# EAGLE design SubBoard_V1 (EAGLE 9.6.2)
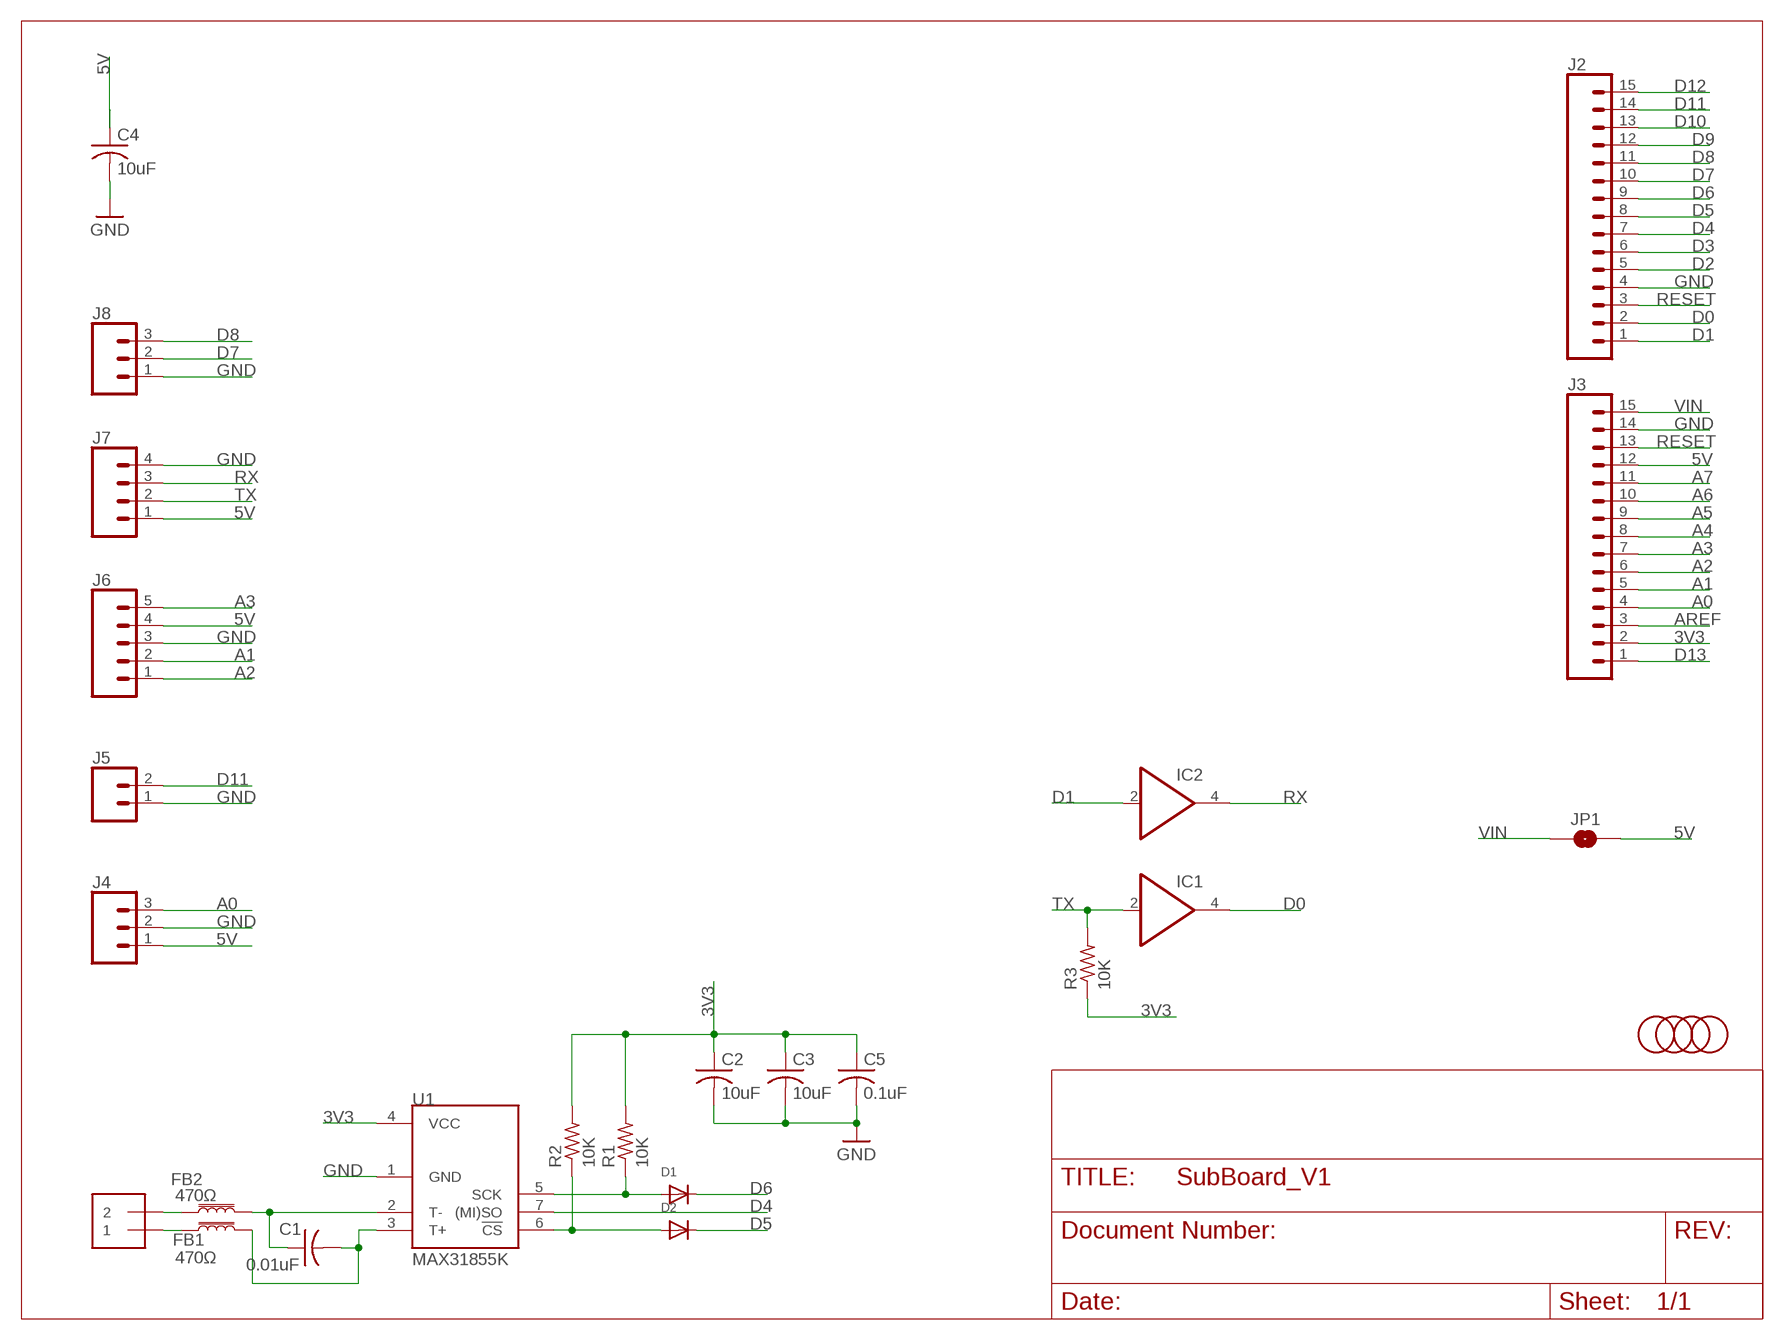
[diagram p0: schematic, sheet 1]

## Parts
C1  0.01uF  C-USC0603  [C0603]
C2  10uF  C-USC0603  [C0603]
C3  10uF  C-USC0603  [C0603]
C4  10uF  C-USC0603  [C0603]
C5  0.1uF  C-USC0603  [C0603]
D1  DIODESOD-523  [SOD-523]
D2  DIODESOD-523  [SOD-523]
FB1  470Ω  FERRITE_BEAD-0603-470Ω-100MHZ-1A-200MILIΩ  [0603]
FB2  470Ω  FERRITE_BEAD-0603-470Ω-100MHZ-1A-200MILIΩ  [0603]
IC1  74LVC1G07DBV  [SOT23-5]
IC2  74LVC1G07DBV  [SOT23-5]
J1  1X2-3.5MM  [1X2-3.5MM]
J2  CONN_15  [1X15]
J3  CONN_15  [1X15]
J4  CONN_03JST-PTH  [JST-3-PTH]
J5  CONN_02JST-PTH-2  [JST-2-PTH]
J6  CONN_05JST  [JST-5-PTH]
J7  CONN_04POLAR  [MOLEX-1X4]
J8  CONN_03JST-PTH  [JST-3-PTH]
JP1  JUMPER-SMT_2_NO_SILK  [SMT-JUMPER_2_NO_SILK]
R1  10K  R-US_R0402  [R0402]
R2  10K  R-US_R0402  [R0402]
R3  10K  R-US_R0402  [R0402]
U1  MAX31855K  [SO08]
U$1  FIDUCIAL  [FIDUCIAL_1MM]
U$2  FIDUCIAL  [FIDUCIAL_1MM]
U$3  FIDUCIAL  [FIDUCIAL_1MM]
U$4  FIDUCIAL  [FIDUCIAL_1MM]

## Nets
3V3: C2.1 C3.1 C5.1 J3.2 R1.2 R2.2 R3.1 U1.4(VCC)
5V: C4.1 J3.12 J4.1 J6.4 J7.1 JP1.2
A0: J3.4 J4.3
A1: J3.5 J6.2
A2: J3.6 J6.1
A3: J3.7 J6.5
A4: J3.8
A5: J3.9
A6: J3.10
A7: J3.11
AREF: J3.3
D0: IC1.4(O) J2.2
D1: IC2.2(I) J2.1
D2: J2.5
D3: J2.6
D4: J2.7 U1.7((MI)SO)
D5: D2.K(C) J2.8
D6: D1.K(C) J2.9
D7: J2.10 J8.2
D8: J2.11 J8.3
D9: J2.12
D10: J2.13
D11: J2.14 J5.2
D12: J2.15
D13: J3.1
GND: C2.2 C3.2 C4.2 C5.2 J2.4 J3.14 J4.2 J5.1 J6.3 J7.4 J8.1 U1.1(GND)
N$1: FB2.1 J1.2
N$2: FB1.1 J1.1
N$3: C1.1 FB2.2 U1.2(T-)
N$4: D1.A R1.1 U1.5(SCK)
N$5: C1.2 FB1.2 U1.3(T+)
N$6: D2.A R2.1 U1.6(!CS)
RESET: J2.3 J3.13
RX: IC2.4(O) J7.3
TX: IC1.2(I) J7.2 R3.2
VIN: J3.15 JP1.1

## Power pins joined to a net without a drawn wire
3V3: IC1.5(VCC) IC2.5(VCC)
GND: IC1.3(GND) IC2.3(GND)

## Library data of the parts
C1 = rcl:C-US: CAPACITOR, American symbol; LCSC: C1589; SPICEPREFIX: C
C2-C4 = rcl:C-US: CAPACITOR, American symbol; LCSC: C19702; SPICEPREFIX: C
C5 = rcl:C-US: CAPACITOR, American symbol; LCSC: C1591; SPICEPREFIX: C
D1 D2 = adafruit:DIODE: Diode SMADIODE - SMA Surface Mount Package 20V 1A Schottky Diode Digikey: 641-1014-6-ND DO-1N4148 - Through Hole Small Current Diode SOD-123 20V 1 A (.5mV Vf) Schottky Diode - Digikey: MBRX120TPMSCT-ND SOD-323 10V 570mA (.38mV Vf, 3ns) Schottky Diode - Digikey: ZLLS410CT-ND SOD-523 30V 30mA Schottky Diode (RB751S-40TE61) - Digikey: RB751S-40TE61CT-ND SOT23-R/W - SOT23 Package (R = Solder Paste/Reflow Ovens, W = Hand-Soldering) BAT54Film 40V 300mA - Digikey: 497-7162-1-ND; LCSC: C232841
FB1 FB2 = SparkFun-Coils:FERRITE_BEAD: Ferrite Bead (blocks, cores, rings, chokes, etc.) Inductor with layers of ferrite used to suppress high frequencies. Often used to isolate high frequency noise. SparkFun Products: IOIO-OTG - V2.2 <https://www.sparkfun.com/products/13613> SparkFun SAMD21 Mini Breakout <https://www.sparkfun.com/products/13664> SparkFun 6 Degrees of Freedom Breakout - LSM6DS3 <https://www.sparkfun.com/products/13339> SparkFun SAMD21 Dev Breakout <https://www.sparkfun.com/products/13672>; LCSC: C883591; PROD_ID: NDUC-12579
IC1 IC2 = 74xx-little-de:74*1G07: Single Buffer/Driver With Open-Drain Output; LCSC: C7829
J1 = adafruit:1X2: 3.5mm Terminal block http://www.ladyada.net/library/pcb/eaglelibrary.html; LCSC: C474892
J2 J3 = SparkFun-Connectors:CONN_15: Multi connection point. Often used as Generic Header-pin footprint for 0.1 inch spaced/style header connections On any of the 0.1 inch spaced packages, you can populate with these: Break Away Headers - Straight <https://www.sparkfun.com/products/116> (PRT-00116) Break Away Male Headers - Right Angle <https://www.sparkfun.com/products/553> (PRT-00553) Female Headers <https://www.sparkfun.com/products/115> (PRT-00115) Break Away Headers - Machine Pin <https://www.sparkfun.com/products/117> (PRT-00117) Break Away Female Headers - Swiss Machine Pin <https://www.sparkfun.com/products/743> (PRT-00743) For SCREWTERMINALS and SPRING TERMINALS visit here: Screw Terimnals on SparkFun.com <https://www.sparkfun.com/search/results?term=Screw+Terminals> (5mm/3.5mm/2.54mm spacing) This device is also useful as a general connection point to wire up your design to another part of your project. Our various solder wires solder well into these plated through hole pads. Hook-Up Wire - Assortment (Stranded, 22 AWG) <https://www.sparkfun.com/products/11375> (PRT-11375) Hook-Up Wire - Assortment (Solid Core, 22 AWG) <https://www.sparkfun.com/products/11367> (PRT-11367) View the entire wire category on our website here <https://www.sparkfun.com/categories/141> Special notes: Molex polarized connector foot print use with SKU : PRT-08231 with associated crimp pins and housings. 1MM SMD Version SKU: PRT-10208 NOTES ON THE VARIANTS LOCK and LOCK_LONGPADS... This footprint was designed to help hold the alignment of a through-hole component (i.e. 6-pin header) while soldering it into place. You may notice that each hole has been shifted either up or down by 0.005 of an inch from it's more standard position (which is a perfectly straight line). This slight alteration caused the pins (the squares in the middle) to touch the edges of the holes. Because they are alternating, it causes a "brace" to hold the component in place. 0.005 has proven to be the perfect amount of "off-center" position when using our standard breakaway headers. Although looks a little odd when you look at the bare footprint, once you have a header in there, the alteration is very hard to notice. Also,if you push a header all the way into place, it is covered up entirely on the bottom side.; LCSC: C2897378
J4 J8 = SparkFun-Connectors:CONN_03: Multi connection point. Often used as Generic Header-pin footprint for 0.1 inch spaced/style header connections On any of the 0.1 inch spaced packages, you can populate with these: Break Away Headers - Straight <https://www.sparkfun.com/products/116> (PRT-00116) Break Away Male Headers - Right Angle <https://www.sparkfun.com/products/553> (PRT-00553) Female Headers <https://www.sparkfun.com/products/115> (PRT-00115) Break Away Headers - Machine Pin <https://www.sparkfun.com/products/117> (PRT-00117) Break Away Female Headers - Swiss Machine Pin <https://www.sparkfun.com/products/743> (PRT-00743) Stackable Header - 3 Pin (Female, 0.1") <https://www.sparkfun.com/products/13875> (PRT-13875) For SCREWTERMINALS and SPRING TERMINALS visit here: Screw Terimnals on SparkFun.com <https://www.sparkfun.com/search/results?term=Screw+Terminals> (5mm/3.5mm/2.54mm spacing) This device is also useful as a general connection point to wire up your design to another part of your project. Our various solder wires solder well into these plated through hole pads. Hook-Up Wire - Assortment (Stranded, 22 AWG) <https://www.sparkfun.com/products/11375> (PRT-11375) Hook-Up Wire - Assortment (Solid Core, 22 AWG) <https://www.sparkfun.com/products/11367> (PRT-11367) View the entire wire category on our website here <https://www.sparkfun.com/categories/141> Special notes: Molex polarized connector foot print use with SKU : PRT-08232 with associated crimp pins and housings.; LCSC: C157929; PROD_ID: WIRE-10037; SF_ID: PRT-09915
J5 = SparkFun-Connectors:CONN_02: Multi connection point. Often used as Generic Header-pin footprint for 0.1 inch spaced/style header connections On any of the 0.1 inch spaced packages, you can populate with these: Break Away Headers - Straight <https://www.sparkfun.com/products/116> (PRT-00116) Break Away Male Headers - Right Angle <https://www.sparkfun.com/products/553> (PRT-00553) Female Headers <https://www.sparkfun.com/products/115> (PRT-00115) Break Away Headers - Machine Pin <https://www.sparkfun.com/products/117> (PRT-00117) Break Away Female Headers - Swiss Machine Pin <https://www.sparkfun.com/products/743> (PRT-00743) For SCREWTERMINALS and SPRING TERMINALS visit here: Screw Terimnals on SparkFun.com <https://www.sparkfun.com/search/results?term=Screw+Terminals> (5mm/3.5mm/2.54mm spacing) This device is also useful as a general connection point to wire up your design to another part of your project. Our various solder wires solder well into these plated through hole pads. Hook-Up Wire - Assortment (Stranded, 22 AWG) <https://www.sparkfun.com/products/11375> (PRT-11375) Hook-Up Wire - Assortment (Solid Core, 22 AWG) <https://www.sparkfun.com/products/11367> (PRT-11367) View the entire wire category on our website here <https://www.sparkfun.com/categories/141> Special notes: Molex polarized connector foot print use with: PRT-08233 with associated crimp pins and housings. 2.54_SCREWTERM for use with PRT-10571. 3.5mm Screw Terminal footprints for PRT-08084 5mm Screw Terminal footprints for use with PRT-08432; LCSC: C173752; PROD_ID: CONN-09863; SKU: PRT-09914
J6 = SparkFun-Connectors:CONN_05: Multi connection point. Often used as Generic Header-pin footprint for 0.1 inch spaced/style header connections On any of the 0.1 inch spaced packages, you can populate with these: Break Away Headers - Straight <https://www.sparkfun.com/products/116> (PRT-00116) Break Away Male Headers - Right Angle <https://www.sparkfun.com/products/553> (PRT-00553) Female Headers <https://www.sparkfun.com/products/115> (PRT-00115) Break Away Headers - Machine Pin <https://www.sparkfun.com/products/117> (PRT-00117) Break Away Female Headers - Swiss Machine Pin <https://www.sparkfun.com/products/743> (PRT-00743) For SCREWTERMINALS and SPRING TERMINALS visit here: Screw Terimnals on SparkFun.com <https://www.sparkfun.com/search/results?term=Screw+Terminals> (5mm/3.5mm/2.54mm spacing) This device is also useful as a general connection point to wire up your design to another part of your project. Our various solder wires solder well into these plated through hole pads. Hook-Up Wire - Assortment (Stranded, 22 AWG) <https://www.sparkfun.com/products/11375> (PRT-11375) Hook-Up Wire - Assortment (Solid Core, 22 AWG) <https://www.sparkfun.com/products/11367> (PRT-11367) View the entire wire category on our website here <https://www.sparkfun.com/categories/141> Special notes: Molex polarized connector foot print use with SKU : PRT-08231 with associated crimp pins and housings. 1MM SMD Version SKU: PRT-10208; LCSC: C157923; SF_ID: PRT-09917
J7 = SparkFun-Connectors:CONN_04: Multi connection point. Often used as Generic Header-pin footprint for 0.1 inch spaced/style header connections On any of the 0.1 inch spaced packages, you can populate with these: Break Away Headers - Straight <https://www.sparkfun.com/products/116> (PRT-00116) Break Away Male Headers - Right Angle <https://www.sparkfun.com/products/553> (PRT-00553) Female Headers <https://www.sparkfun.com/products/115> (PRT-00115) Break Away Headers - Machine Pin <https://www.sparkfun.com/products/117> (PRT-00117) Break Away Female Headers - Swiss Machine Pin <https://www.sparkfun.com/products/743> (PRT-00743) For SCREWTERMINALS and SPRING TERMINALS visit here: Screw Terimnals on SparkFun.com <https://www.sparkfun.com/search/results?term=Screw+Terminals> (5mm/3.5mm/2.54mm spacing) This device is also useful as a general connection point to wire up your design to another part of your project. Our various solder wires solder well into these plated through hole pads. Hook-Up Wire - Assortment (Stranded, 22 AWG) <https://www.sparkfun.com/products/11375> (PRT-11375) Hook-Up Wire - Assortment (Solid Core, 22 AWG) <https://www.sparkfun.com/products/11367> (PRT-11367) View the entire wire category on our website here <https://www.sparkfun.com/categories/141> Special notes: Molex polarized connector foot print use with SKU : PRT-08231 with associated crimp pins and housings. 1MM SMD Version SKU: PRT-10208; LCSC: C163037; PROD_ID: CONN-08186; SF_ID: PRT-08231
JP1 = SparkFun-Jumpers:JUMPER-SMT_2_NO: Normally open jumper This jumper has two pads in close proximity to each other. Apply solder to close the connection. Round pads are easier to solder for beginners, but are a lot larger. SparkFun Product that uses the round pads: SparkFun EL Sequencer <https://www.sparkfun.com/products/12781>
R1-R3 = rcl:R-US_: RESISTOR, American symbol; LCSC: C60490; SPICEPREFIX: R
U1 = SparkFun-IC-Conversion:MAX31855K: Cold-Junction-Compensated K-Thermocoupleto-Digital Converter (-270°C to +1800°C) The MAX31855K performs cold-junction compensation and digitizes the signal from a type-K thermocouple. The data is output in a 14-bit resolution, SPI™-compatible, read-only format. This converter resolves temperatures to 0.25°C, allows readings as high as +1800°C and as low as -270°C, and exhibits thermocouple accuracy of ±2°C for temperatures ranging from -200°C to +700°C for K-type thermocouples. Datasheet <https://cdn.sparkfun.com/datasheets/Sensors/Temp/MAX31855K.pdf> SparkFun Products SparkFun Thermocouple Breakout - MAX31855K <https://www.sparkfun.com/products/13266> (SEN-13266); LCSC: C52028; PROD_ID: IC-12578
U$1-U$4 = adafruit:FIDUCIAL: For use by pick and place machines to calibrate the vision/machine, 1mm By microbuilder.eu

## Board
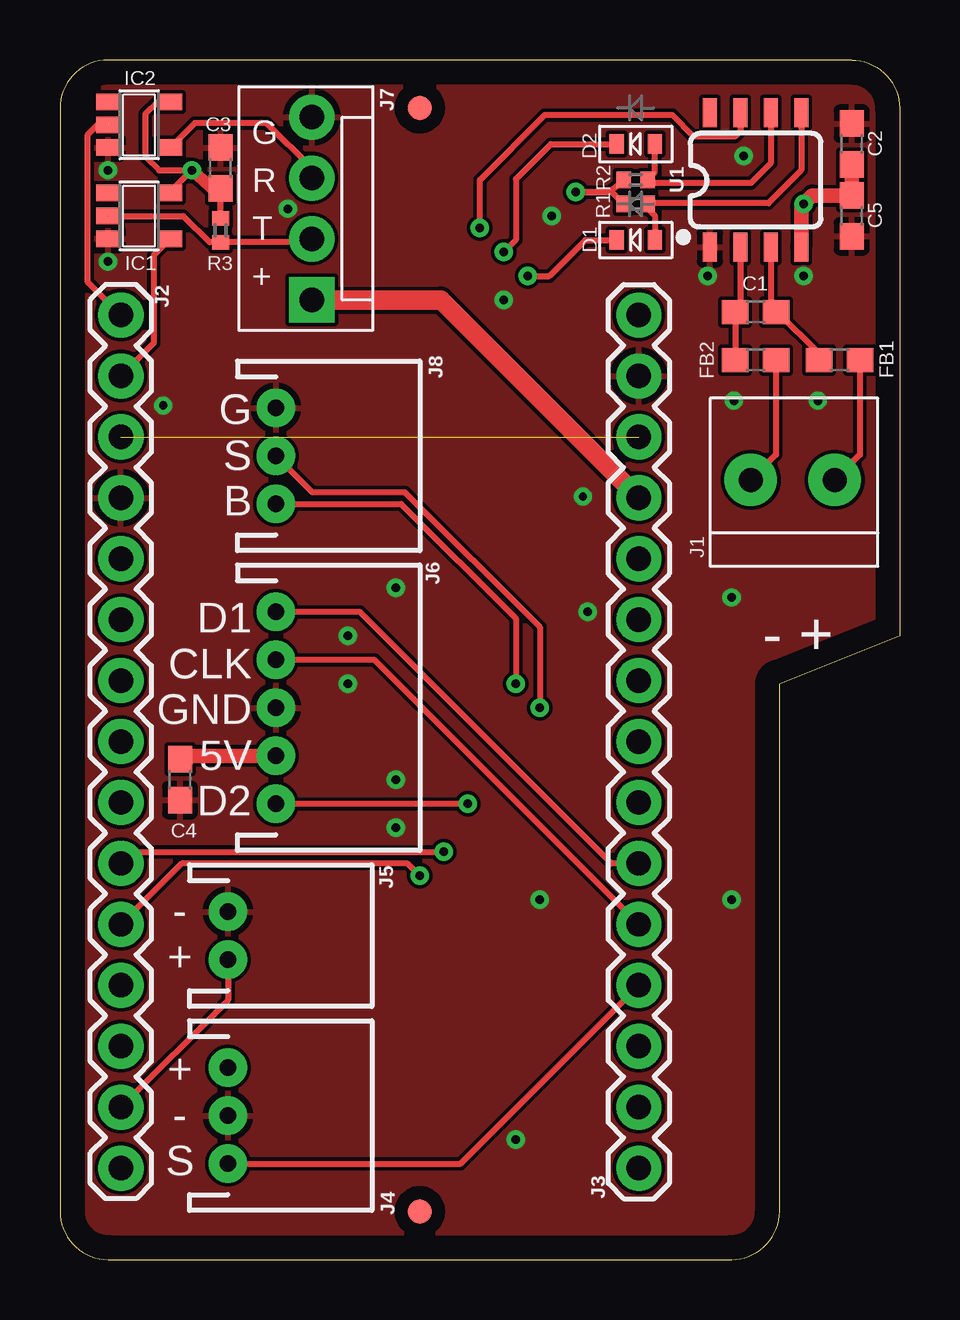
[diagram p1: board, top side]
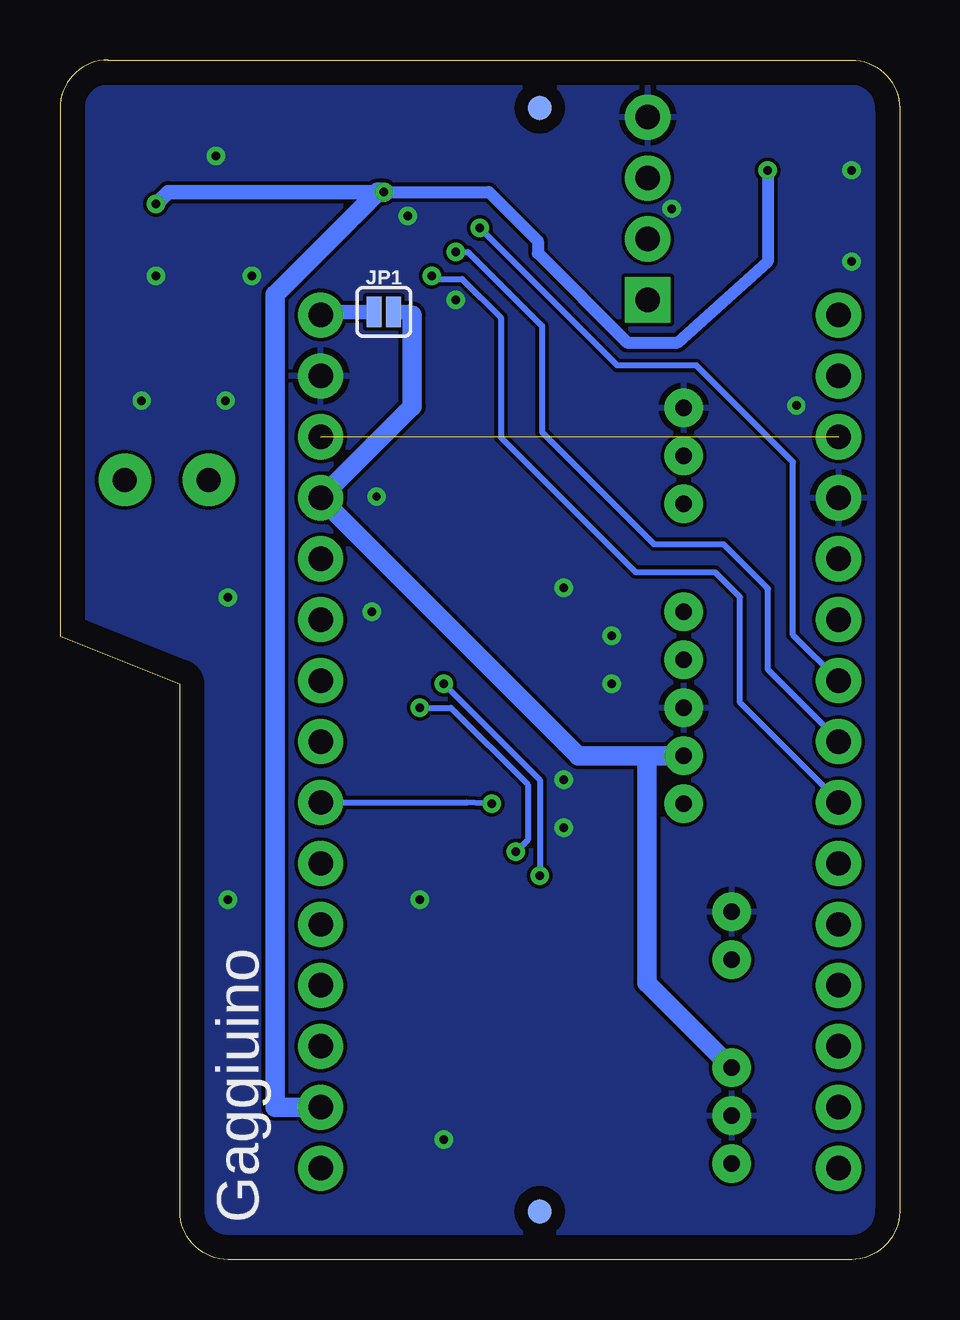
[diagram p2: board, bottom side, seen from below]

Size 35 x 50 mm. Coordinates in mm from the lower left corner, seen from the top.
Outline: 2,0 28,0 arc90 30,2 30,24 35,26 35,48 arc90 33,50 2,50 arc90 0,48 0,2 arc90 2,0
Copper layers (1*16): Top 0.035mm / dielectric 1.5mm / Bottom 0.035mm
Design rules "default": minimum track width 6mil, minimum drill 0.35mm, track to track 6mil, track to pad 6mil, pad to pad 6mil, via to via 6mil, smd to smd 6mil, copper to edge 40mil, drill to drill 6mil, minimum pad ring 10mil, minimum via ring 8mil, stop-mask expansion 4mil, vias tented up to drill 0mil, thermal gap 10mil

### Footprints (pad centres in the part's own frame; a part is rotated, then mirrored left to right if it is on the bottom)
C0603 = smd 1.1 x 1: 1 -0.85,0; 2 0.85,0
SOD-523 = smd 0.8 x 0.6: A 0,-0.8; K 0,0.8
0603 = smd 1.1 x 1: 1 -0.85,0; 2 0.85,0
SOT23-5 = smd 0.69 x 0.99: 1 -0.95,-1.29; 2 0,-1.29; 3 0.95,-1.29; 4 0.95,1.3; 5 -0.95,1.3
1X2-3.5MM = drill 1 pad 2.184: 1 1.8,0; 2 -1.7,0
1X15 = drill 1.016 pad 1.88: 1 0,0; 2 2.54,0; 3 5.08,0; 4 7.62,0; 5 10.16,0; 6 12.7,0; 7 15.24,0; 8 17.78,0; 9 20.32,0; 10 22.86,0; 11 25.4,0; 12 27.94,0; 13 30.48,0; 14 33.02,0; 15 35.56,0
JST-3-PTH = drill 0.7 pad 1.6: 1 -2,0; 2 0,0; 3 2,0
JST-2-PTH = drill 0.7 pad 1.6: 1 -1,0; 2 1,0
JST-5-PTH = drill 0.7 pad 1.6: 1 -4,0; 2 -2,0; 3 0,0; 4 2,0; 5 4,0
MOLEX-1X4 = drill 1.016 pad 1.88 square: 1 0,0 | drill 1.016 pad 1.88: 2 2.54,0; 3 5.08,0; 4 7.62,0
SMT-JUMPER_2_NO_SILK = smd 0.635 x 1.27: 1 -0.406,0; 2 0.406,0
R0402 = smd 0.6 x 0.7: 1 -0.5,0; 2 0.5,0
SO08 = smd 0.6 x 1.2: 1 -1.905,-2.8; 2 -0.635,-2.8; 3 0.635,-2.8; 4 1.905,-2.8; 5 1.905,2.8; 6 0.635,2.8; 7 -0.635,2.8; 8 -1.905,2.8
FIDUCIAL_1MM = smd 1 x 1: 1 0,0

### Placement (x,y rotation side)
C1  29,39.5 0 top
C2  33,46.5 90 top
C3  6.7,45.5 90 top
C4  5,20 270 top
C5  33,43.5 270 top
D1  24,42.5 90 top
D2  24,46.5 90 top
FB1  32.5,37.5 180 top
FB2  29,37.5 180 top
IC1  3.3,43.5 270 top
IC2  3.3,47.3 270 top
J1  30.5,32.5 0 top
J2  2.54,39.37 270 top
J3  24.13,3.81 90 top
J4  7,6 270 top
J5  7,13.5 270 top
J6  9,23 270 top
J7  10.5,40 90 top
J8  9,33.5 270 top
JP1  21.5,39.5 0 bottom
R1  24,44 180 top
R2  24,45 180 top
R3  6.7,42.9 270 top
U1  29,45 0 top
U$1  15,48 0 top
U$2  15,2 0 top
U$3  15,48 0 bottom
U$4  15,2 0 bottom

### Tracks (layer width: path | path; a pad name or v marks a point on that pad's centre or on a via)
3V3  (via drill 0.35)
  Top 0.254: R2.2 22.9,44.5 v21.5,44.5 23,44.5 R1.2 | IC1.5 4.6,44.5 v5.5,45.4 4.13,45.4 3.56,45.97 3.56,47.75 4.05,48.25 IC2.5 | R3.1 C3.1
  Top 0.508: C3.1 6.49,44.51 v5.5,45.4
  Top 0.61: C2.1 C5.1 31.35,44.35 v31,44 30.91,43.91 U1.4
  Bottom 0.508: v21.5,44.5 17.12,44.5 15.07,42.46 15.07,41.95 11.36,38.23 9.24,38.23 5.5,41.6 v5.5,45.4
  Bottom 0.61: v31,44 30.5,44.5 v21.5,44.5
  Bottom 0.813: J3.2 26.04,6.35 26.04,40.21 21.75,44.5 v21.5,44.5
5V
  Top 0.61: C4.1 5.15,20.7 5.44,21 J6.4
  Top 0.813: J3.12 15.88,40 J7.1
  Bottom 0.61: 20.32,39.37 20.45,39.5 JP1.2
  Bottom 0.813: 20.32,39.37 20.32,35.56 J3.12 13.38,21 J6.4 10.4,21 10.54,20.86 10.54,11.54 J4.1
A0
  Top 0.254: J4.3 16.7,4 J3.4
A1
  Top 0.254: J3.5 13.12,24.98 9.02,24.98 J6.2
A2
  Top 0.254: J6.1 9.02,26.98 12.51,26.98 22.99,16.51 J3.6
A3  (via drill 0.35)
  Top 0.254: v17,19 J6.5
  Bottom 0.254: v17,19 18.05,19.05 J3.7
D0
  Top 0.254: IC1.4 3.91,41.86 3.91,38.2 J2.2
D1
  Top 0.254: IC2.2 1.58,47.3 1.14,46.86 1.14,40.77 J2.1
D4  (via drill 0.35)
  Top 0.254: v17.5,43 17.5,44.99 20.2,47.7 25.53,47.7 26.42,46.81 28.14,46.81 28.36,47.04 U1.7
  Bottom 0.254: J2.7 4.45,26.04 4.45,33.25 8.46,37.26 11.76,37.26 v17.5,43
D5  (via drill 0.35)
  Top 0.254: D2.K 20.47,46.5 19.01,45.04 19.01,42.51 v18.5,42
  Bottom 0.254: J2.8 2.54,21.64 5.49,24.59 5.49,27.96 7.34,29.82 10.24,29.82 14.9,34.48 14.9,38.91 17.99,42 v18.5,42
D6  (via drill 0.35)
  Top 0.254: v19.5,41 20.4,41 21.9,42.5 D1.K
  Bottom 0.254: J2.9 2.54,19.1 6.66,23.22 6.66,27.61 7.7,28.65 11.01,28.65 16.62,34.26 16.62,39.26 18.23,40.87 19.37,40.87 v19.5,41
D7  (via drill 0.35)
  Top 0.254: J8.2 10.52,31.98 14.38,31.98 20,26.36 v20,23 | J2.10 3.03,17 v16,17
  Bottom 0.254: v20,23 18.7,23 15.5,19.8 15.5,17.5 v16,17
D8  (via drill 0.35)
  Top 0.254: J8.3 14.22,31.5 19,26.72 v19,24 | v15,16 14.49,16.51 5.08,16.51 J2.11
  Bottom 0.254: v19,24 15,20 v15,16
D11
  Top 0.254: J2.14 7,10.81 J5.2
GND  (via drill 0.35)
  other vias: 4.3,35.6 18.5,40 14,28 28.1,35.8 31.6,35.8 28,27.6 22,27 20,15 28,15 19,5 21.8,31.8 27,41 20.5,43.5 31,41 2,41.6 2,45.4 28.5,46 9.5,43.8 12,26 12,24 14,20 14,18
  pour Bottom: 0,0 0,50 35,50 35,0
  pour Top: 0,0 0,50 35,50 35,0
N$1
  Top 0.254: FB2.1 29.85,33.55 J1.2
N$2
  Top 0.254: FB1.1 33.35,33.55 J1.1
N$3
  Top 0.254: U1.2 28.36,39.72 C1.1 FB2.2
N$4
  Top 0.254: D1.A 24.8,43.52 24.41,43.91 R1.1 24.53,44.03 29.54,44.03 30.91,45.4 U1.5
N$5
  Top 0.254: U1.3 29.64,39.72 C1.2 29.9,39.5 31.65,37.75 FB1.2
N$6
  Top 0.254: D2.A 24.8,45.33 24.53,45.06 R2.1 24.73,44.87 28.81,44.87 29.64,45.7 U1.6
RESET  (1 unrouted)
RX
  Top 0.254: IC2.4 5.62,47.37 8.62,47.37 10.5,45.49 J7.3
TX
  Top 0.254: IC1.2 5.14,43.5 6.24,42.4 R3.2 10.36,42.4 J7.2
VIN
  Bottom 0.61: JP1.1 24,39.5 J3.15

### Text on the board
tNames: G / R / T / + | G / S / B | - + | D1 / CLK / GND / 5V / D2 | - / + | + / - / S
bNames: Gaggiuino